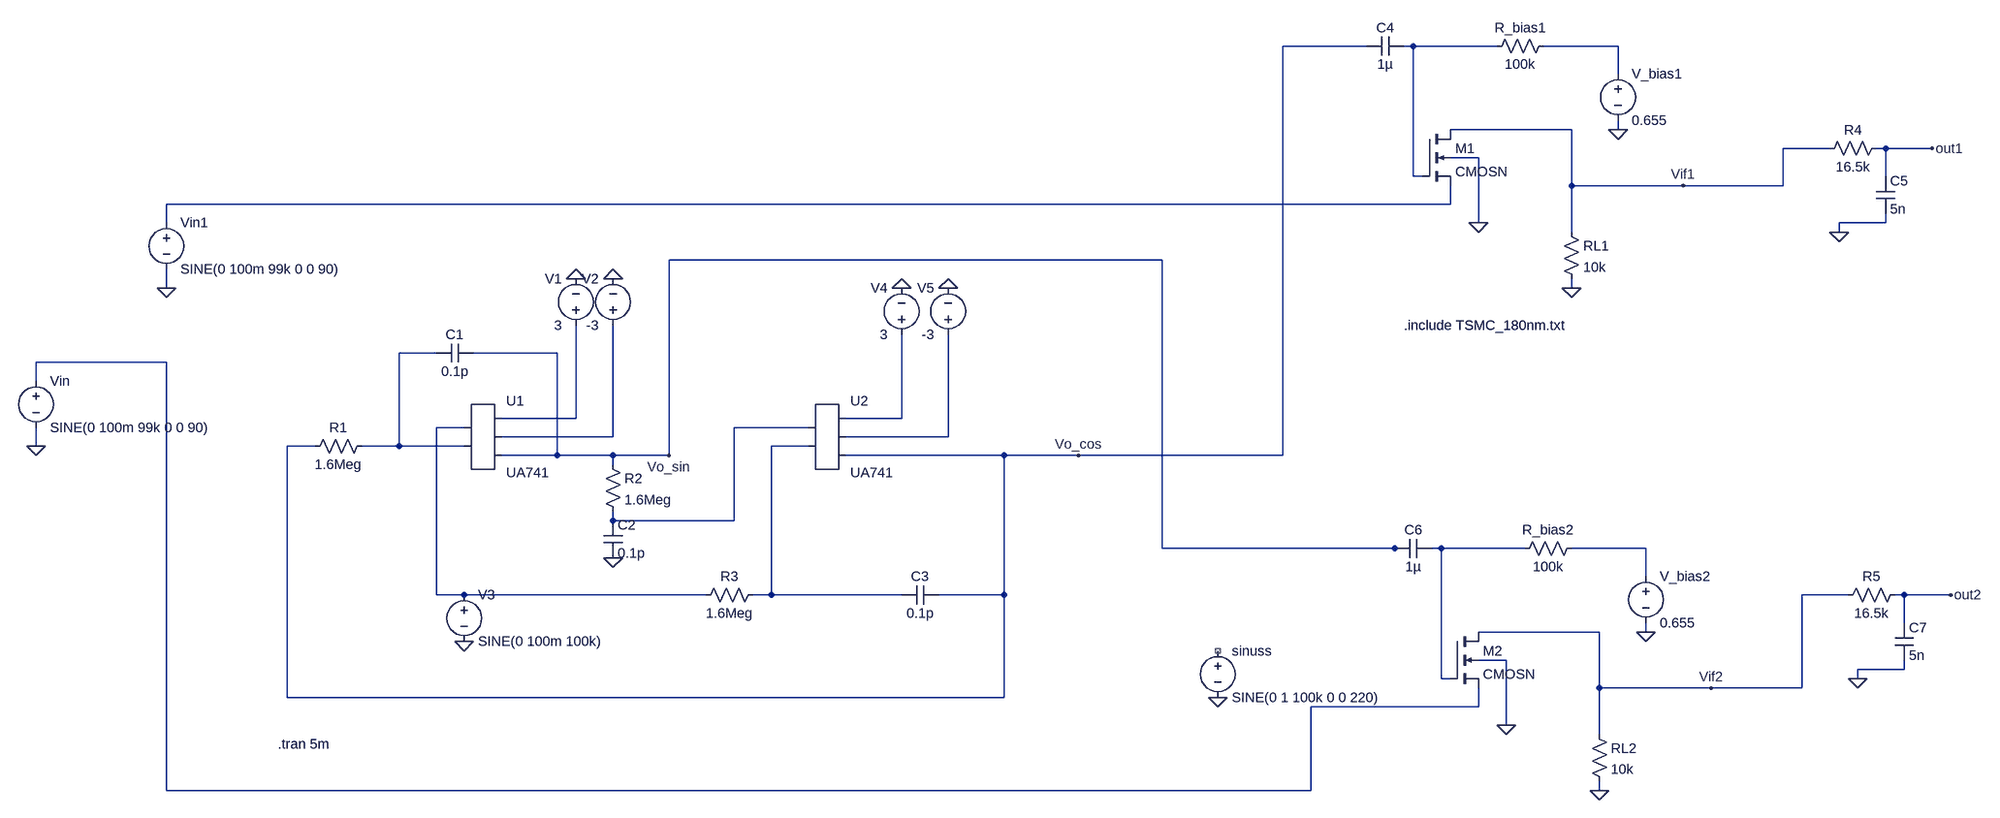
[diagram p0: schematic DownConvertor.asc]
DownConvertor.asc, the LTspice schematic file:
Version 4
SHEET 1 2968 800
WIRE 1632 -560 1488 -560
WIRE 1712 -560 1696 -560
WIRE 1856 -560 1712 -560
WIRE 2064 -560 1936 -560
WIRE 2064 -512 2064 -560
WIRE 1984 -416 1776 -416
WIRE 2064 -416 2064 -432
WIRE 2688 -384 2608 -384
WIRE 2784 -384 2768 -384
WIRE 2864 -384 2784 -384
WIRE 1824 -368 1776 -368
WIRE 1712 -336 1712 -560
WIRE 1728 -336 1712 -336
WIRE 2784 -336 2784 -384
WIRE 1984 -320 1984 -416
WIRE 2176 -320 1984 -320
WIRE 2608 -320 2608 -384
WIRE 2608 -320 2176 -320
WIRE 1776 -288 1776 -320
WIRE 1776 -288 -480 -288
WIRE -480 -256 -480 -288
WIRE 1824 -256 1824 -368
WIRE 2784 -256 2784 -272
WIRE 2784 -256 2704 -256
WIRE 1984 -240 1984 -320
WIRE 2704 -240 2704 -256
WIRE 1280 -192 384 -192
WIRE -480 -144 -480 -176
WIRE 1984 -144 1984 -160
WIRE -16 -32 -80 -32
WIRE 192 -32 48 -32
WIRE -480 -16 -704 -16
WIRE -704 16 -704 -16
WIRE 224 80 224 -80
WIRE 224 80 96 80
WIRE 784 80 784 -64
WIRE 784 80 688 80
WIRE 32 96 -16 96
WIRE 624 96 496 96
WIRE 288 112 288 -80
WIRE 288 112 96 112
WIRE 864 112 864 -64
WIRE 864 112 688 112
WIRE -704 128 -704 96
WIRE -224 128 -272 128
WIRE -80 128 -80 -32
WIRE -80 128 -144 128
WIRE 32 128 -80 128
WIRE 624 128 560 128
WIRE 192 144 192 -32
WIRE 192 144 96 144
WIRE 288 144 192 144
WIRE 384 144 384 -192
WIRE 384 144 288 144
WIRE 960 144 688 144
WIRE 1088 144 960 144
WIRE 1488 144 1488 -560
WIRE 1488 144 1088 144
WIRE 288 160 288 144
WIRE 288 256 288 240
WIRE 496 256 496 96
WIRE 496 256 288 256
WIRE 1280 304 1280 -192
WIRE 1680 304 1280 304
WIRE 1696 304 1680 304
WIRE 1760 304 1744 304
WIRE 1904 304 1760 304
WIRE 2112 304 1984 304
WIRE 2112 352 2112 304
WIRE -16 384 -16 96
WIRE 32 384 -16 384
WIRE 448 384 32 384
WIRE 560 384 560 128
WIRE 560 384 528 384
WIRE 784 384 560 384
WIRE 960 384 960 144
WIRE 960 384 848 384
WIRE 2720 384 2640 384
WIRE 2816 384 2800 384
WIRE 2896 384 2816 384
WIRE 2816 432 2816 384
WIRE 2032 448 1824 448
WIRE 2112 448 2112 432
WIRE 1872 496 1824 496
WIRE 2816 512 2816 496
WIRE 2816 512 2736 512
WIRE 1760 528 1760 304
WIRE 1776 528 1760 528
WIRE 2736 528 2736 512
WIRE 2032 544 2032 448
WIRE 2224 544 2032 544
WIRE 2640 544 2640 384
WIRE 2640 544 2224 544
WIRE -272 560 -272 128
WIRE 960 560 960 384
WIRE 960 560 -272 560
WIRE 1824 576 1824 544
WIRE 1824 576 1536 576
WIRE 1872 608 1872 496
WIRE 2032 624 2032 544
WIRE -480 720 -480 -16
WIRE 1536 720 1536 576
WIRE 1536 720 -480 720
WIRE 2032 720 2032 704
FLAG 224 -160 0
FLAG 288 -160 0
FLAG 288 320 0
FLAG 32 464 0
FLAG 784 -144 0
FLAG 864 -144 0
FLAG 384 144 Vo_sin
FLAG 1088 144 Vo_cos
FLAG 2064 -416 0
FLAG 1984 -144 0
FLAG 1824 -256 0
FLAG 2176 -320 Vif1
FLAG 2704 -240 0
FLAG 2864 -384 out1
FLAG 2112 448 0
FLAG 2032 720 0
FLAG 1872 608 0
FLAG 2224 544 Vif2
FLAG 2736 528 0
FLAG 2896 384 out2
FLAG -704 128 0
FLAG -480 -144 0
FLAG 1376 560 0
SYMBOL AutoGenerated\\UA741 64 112 R0
SYMATTR InstName U1
SYMBOL cap 48 -48 R90
WINDOW 0 0 32 VBottom 2
WINDOW 3 32 32 VTop 2
SYMATTR InstName C1
SYMATTR Value 0.1p
SYMBOL res -128 112 R90
WINDOW 0 0 56 VBottom 2
WINDOW 3 32 56 VTop 2
SYMATTR InstName R1
SYMATTR Value 1.6Meg
SYMBOL voltage 224 -64 R180
WINDOW 0 24 96 Left 2
WINDOW 3 24 16 Left 2
WINDOW 123 0 0 Left 0
WINDOW 39 0 0 Left 0
SYMATTR InstName V1
SYMATTR Value 3
SYMBOL voltage 288 -64 R180
WINDOW 0 24 96 Left 2
WINDOW 3 24 16 Left 2
WINDOW 123 0 0 Left 0
WINDOW 39 0 0 Left 0
SYMATTR InstName V2
SYMATTR Value -3
SYMBOL res 544 368 R90
WINDOW 0 0 56 VBottom 2
WINDOW 3 32 56 VTop 2
SYMATTR InstName R3
SYMATTR Value 1.6Meg
SYMBOL AutoGenerated\\UA741 656 112 R0
SYMATTR InstName U2
SYMBOL res 272 144 R0
SYMATTR InstName R2
SYMATTR Value 1.6Meg
SYMBOL cap 272 256 R0
SYMATTR InstName C2
SYMATTR Value 0.1p
SYMBOL voltage 32 368 R0
WINDOW 123 0 0 Left 0
WINDOW 39 0 0 Left 0
SYMATTR InstName V3
SYMATTR Value SINE(0 100m 100k)
SYMBOL cap 848 368 R90
WINDOW 0 0 32 VBottom 2
WINDOW 3 32 32 VTop 2
SYMATTR InstName C3
SYMATTR Value 0.1p
SYMBOL voltage 784 -48 R180
WINDOW 0 24 96 Left 2
WINDOW 3 24 16 Left 2
WINDOW 123 0 0 Left 0
WINDOW 39 0 0 Left 0
SYMATTR InstName V4
SYMATTR Value 3
SYMBOL voltage 864 -48 R180
WINDOW 0 24 96 Left 2
WINDOW 3 24 16 Left 2
WINDOW 123 0 0 Left 0
WINDOW 39 0 0 Left 0
SYMATTR InstName V5
SYMATTR Value -3
SYMBOL voltage 2064 -528 R0
WINDOW 123 0 0 Left 0
WINDOW 39 0 0 Left 0
SYMATTR InstName V_bias1
SYMATTR Value 0.655
SYMBOL res 1968 -256 R0
SYMATTR InstName RL1
SYMATTR Value 10k
SYMBOL res 1952 -576 R90
WINDOW 0 0 56 VBottom 2
WINDOW 3 32 56 VTop 2
SYMATTR InstName R_bias1
SYMATTR Value 100k
SYMBOL cap 1696 -576 R90
WINDOW 0 0 32 VBottom 2
WINDOW 3 32 32 VTop 2
SYMATTR InstName C4
SYMATTR Value 1µ
SYMBOL nmos4 1728 -416 R0
SYMATTR InstName M1
SYMATTR Value2 l=0.09u w=1.8u ad=0.81p as=0.81p pd=4.5u ps=4.5u
SYMATTR Value CMOSN
SYMBOL cap 2768 -336 R0
SYMATTR InstName C5
SYMATTR Value 5n
SYMBOL res 2784 -400 R90
WINDOW 0 0 56 VBottom 2
WINDOW 3 32 56 VTop 2
SYMATTR InstName R4
SYMATTR Value 16.5k
SYMBOL voltage 2112 336 R0
WINDOW 123 0 0 Left 0
WINDOW 39 0 0 Left 0
SYMATTR InstName V_bias2
SYMATTR Value 0.655
SYMBOL res 2016 608 R0
SYMATTR InstName RL2
SYMATTR Value 10k
SYMBOL res 2000 288 R90
WINDOW 0 0 56 VBottom 2
WINDOW 3 32 56 VTop 2
SYMATTR InstName R_bias2
SYMATTR Value 100k
SYMBOL cap 1744 288 R90
WINDOW 0 0 32 VBottom 2
WINDOW 3 32 32 VTop 2
SYMATTR InstName C6
SYMATTR Value 1µ
SYMBOL nmos4 1776 448 R0
SYMATTR InstName M2
SYMATTR Value2 l=0.09u w=1.8u ad=0.81p as=0.81p pd=4.5u ps=4.5u
SYMATTR Value CMOSN
SYMBOL cap 2800 432 R0
SYMATTR InstName C7
SYMATTR Value 5n
SYMBOL res 2816 368 R90
WINDOW 0 0 56 VBottom 2
WINDOW 3 32 56 VTop 2
SYMATTR InstName R5
SYMATTR Value 16.5k
SYMBOL voltage -704 0 R0
WINDOW 123 0 0 Left 0
WINDOW 39 0 0 Left 0
SYMATTR InstName Vin
SYMATTR Value SINE(0 100m 99k 0 0 90)
SYMBOL voltage -480 -272 R0
WINDOW 123 0 0 Left 0
WINDOW 39 0 0 Left 0
SYMATTR InstName Vin1
SYMATTR Value SINE(0 100m 99k 0 0 90)
SYMBOL voltage 1376 464 R0
WINDOW 123 0 0 Left 0
WINDOW 39 0 0 Left 0
SYMATTR InstName sinuss
SYMATTR Value SINE(0 1 100k 0 0 220)
TEXT -288 640 Left 2 !.tran 5m
TEXT 1696 -80 Left 2 !.include TSMC_180nm.txt

The netlist it stands for:
* DownConvertor.asc
* U1: UA741 (symbol AutoGenerated\UA741 not available, pins judged from their places): pin1=N008 pin2=N004 pin3=N006 pin4=N010 pin5=Vo_sin
C1 Vo_sin N004 0.1p
R1 N004 Vo_cos 1.6Meg
V1 N006 0 3
V2 N010 0 -3
R3 N012 N008 1.6Meg
* U2: UA741 (symbol AutoGenerated\UA741 not available, pins judged from their places): pin1=N009 pin2=N012 pin3=N007 pin4=N011 pin5=Vo_cos
R2 Vo_sin N009 1.6Meg
C2 N009 0 0.1p
V3 N008 0 SINE(0 100m 100k)
C3 Vo_cos N012 0.1p
V4 N007 0 3
V5 N011 0 -3
V_bias1 N002 0 0.655
RL1 Vif1 0 10k
R_bias1 N002 N001 100k
C4 N001 Vo_cos 1µ
M1 Vif1 N001 N003 0 CMOSN l=0.09u w=1.8u ad=0.81p as=0.81p pd=4.5u ps=4.5u
C5 out1 0 5n
R4 out1 Vif1 16.5k
V_bias2 N014 0 0.655
RL2 Vif2 0 10k
R_bias2 N014 N013 100k
C6 N013 Vo_sin 1µ
M2 Vif2 N013 N005 0 CMOSN l=0.09u w=1.8u ad=0.81p as=0.81p pd=4.5u ps=4.5u
C7 out2 0 5n
R5 out2 Vif2 16.5k
Vin N005 0 SINE(0 100m 99k 0 0 90)
Vin1 N003 0 SINE(0 100m 99k 0 0 90)
V§sinuss NC_01 0 SINE(0 1 100k 0 0 220)
.model NMOS NMOS
.model PMOS PMOS
.lib standard.mos
.tran 5m
.include TSMC_180nm.txt
.backanno
.end